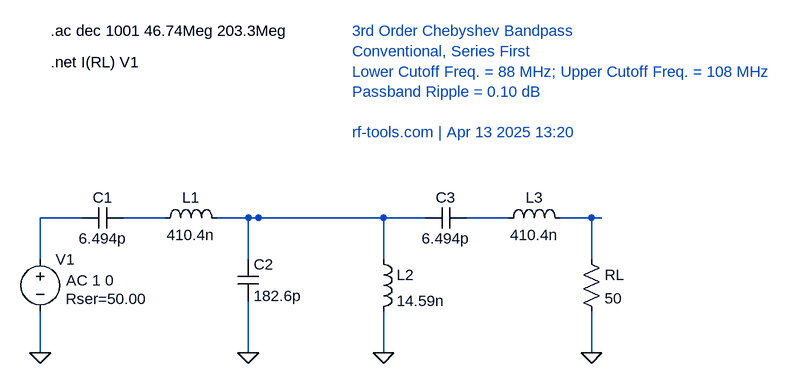
[diagram p0: schematic marki_microwave_export.asc]
marki_microwave_export.asc, the LTspice schematic file:
Version 4
SHEET 1 1200 400
WIRE 0 0 0 64
WIRE 0 144 0 208
WIRE 0 0 64 0
WIRE 128 0 192 0
WIRE 272 0 336 0
WIRE 320 0 320 64
WIRE 320 128 320 208
WIRE 320 0 528 0
WIRE 528 0 528 64
WIRE 528 144 528 208
WIRE 528 0 592 0
WIRE 656 0 720 0
WIRE 800 0 864 0
WIRE 848 0 848 64
WIRE 848 144 848 208
FLAG 0 208 0
FLAG 320 208 0
FLAG 528 208 0
FLAG 848 208 0
SYMBOL voltage 0 48 R0
WINDOW 123 40 48 Left 2
WINDOW 39 39 77 Left 2
SYMATTR InstName V1
SYMATTR Value ""
SYMATTR Value2 AC 1 0
SYMATTR SpiceLine Rser=50.00
SYMBOL cap 64 16 R270
SYMATTR InstName C1
SYMATTR Value 6.494p
WINDOW 0 32 32 VTop 2
WINDOW 3 0 32 VBottom 2
SYMBOL ind 176 16 R270
SYMATTR InstName L1
SYMATTR Value 410.4n
WINDOW 0 32 56 VTop 2
WINDOW 3 5 56 VBottom 2
SYMBOL cap 304 64 R0
SYMATTR InstName C2
SYMATTR Value 182.6p
SYMBOL ind 512 48 R0
SYMATTR InstName L2
SYMATTR Value 14.59n
SYMBOL cap 592 16 R270
SYMATTR InstName C3
SYMATTR Value 6.494p
WINDOW 0 32 32 VTop 2
WINDOW 3 0 32 VBottom 2
SYMBOL ind 704 16 R270
SYMATTR InstName L3
SYMATTR Value 410.4n
WINDOW 0 32 56 VTop 2
WINDOW 3 5 56 VBottom 2
SYMBOL res 832 48 R0
SYMATTR InstName RL
SYMATTR Value 50
TEXT 16 -288 Left 2 !.ac dec 1001 46.74Meg 203.3Meg
TEXT 16 -240 Left 2 !.net I(RL) V1
TEXT 480 -288 Left 2 ;3rd Order Chebyshev Bandpass\nConventional, Series First\nLower Cutoff Freq. = 88 MHz; Upper Cutoff Freq. = 108 MHz\nPassband Ripple = 0.10 dB\n\nrf-tools.com | Apr 13 2025 13:20

The netlist it stands for:
* marki_microwave_export.asc
V1 N001 0 AC 1 0 Rser=50.00
C1 N001 N002 6.494p
L1 N002 N003 410.4n
C2 N003 0 182.6p
L2 N003 0 14.59n
C3 N003 N004 6.494p
L3 N004 N005 410.4n
RL N005 0 50
.ac dec 1001 46.74Meg 203.3Meg
.net I(RL) V1
* 3rd Order Chebyshev Bandpass
* Conventional, Series First
* Lower Cutoff Freq. = 88 MHz; Upper Cutoff Freq. = 108 MHz
* Passband Ripple = 0.10 dB
* rf-tools.com | Apr 13 2025 13:20
.backanno
.end